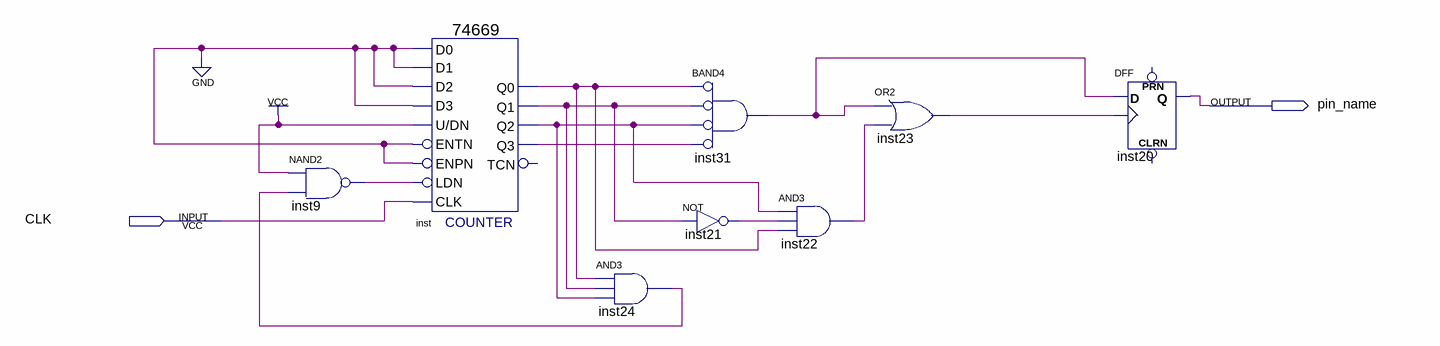
[diagram p0: schematic sheet]
// Quartus schematic Lab2.bdf as structural Verilog: 8 symbols, 2 pins
module Lab2 (
  input  CLK,
  output pin_name
);

  wire inst9_out, inst21_out, inst22_out, inst23_out, inst24_out, inst31_out, inst_q0, inst_q1, inst_q2,
       inst_q3;

  nand inst9 (inst9_out, 1'b1, inst24_out);
  \74669  inst (
    .D1(1'b0), .D3(1'b0), .D2(1'b0), .\U/DN (1'b1), .ENTN(1'b0), .LDN(inst9_out), .CLK(CLK), .ENPN(1'b0),
    .D0(1'b0), .Q2(inst_q2), .Q3(inst_q3), .Q1(inst_q1), .Q0(inst_q0));  // open: TCN
  and inst24 (inst24_out, inst_q0, inst_q1, inst_q2);
  not inst21 (inst21_out, inst_q1);
  and inst31 (inst31_out, ~inst_q0, ~inst_q1, ~inst_q2, ~inst_q3);  // BAND4
  and inst22 (inst22_out, inst_q2, inst21_out, inst_q0);
  or inst23 (inst23_out, inst31_out, inst22_out);
  DFF inst20 (.CLK(inst23_out), .D(inst31_out), .Q(pin_name));  // open: CLRN, PRN
endmodule
